# Altium schematic sheet DiplomScheme.SchDoc
size A0; SheetNumber: 1; SheetTotal: 1
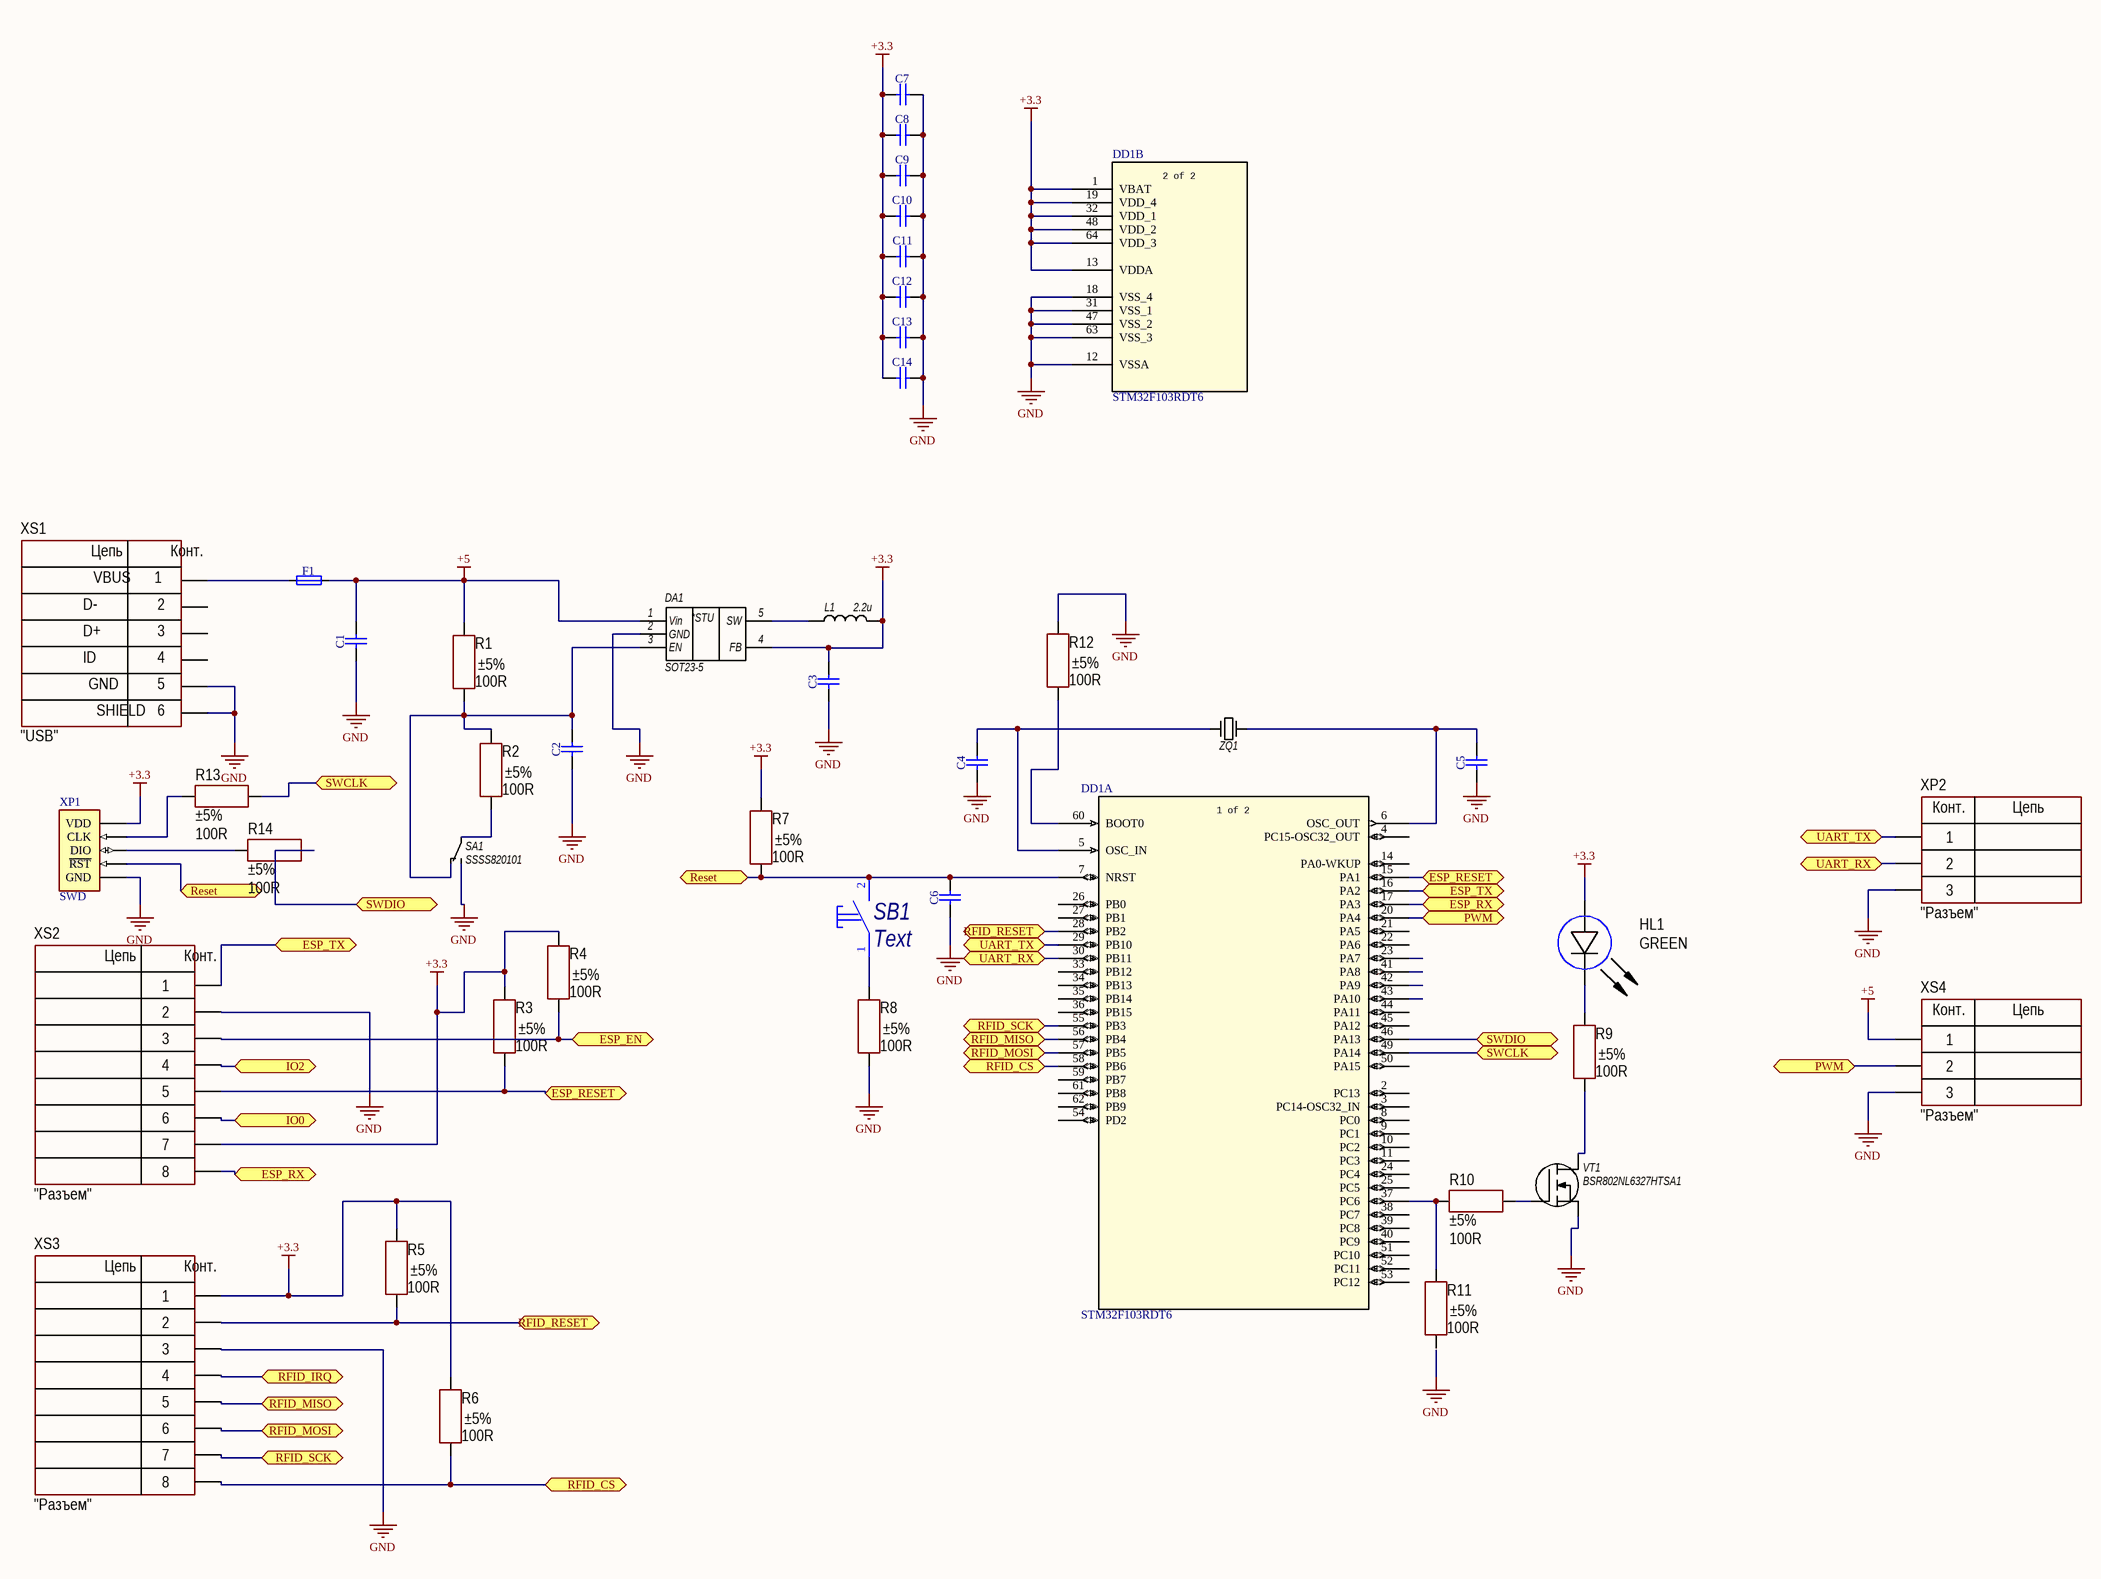
[diagram p0: DiplomScheme.SchDoc]

## Parts
C1  47p  [C0805]  (value not drawn)
C2  47p  [C0805]  (value not drawn)
C3  47p  [C0805]  (value not drawn)
C4  47p  [C0805]  (value not drawn)
C5  47p  [C0805]  (value not drawn)
C6  47p  [C0805]  (value not drawn)
C7  47p  [C0805]  (value not drawn)
C8  47p  [C0805]  (value not drawn)
C9  47p  [C0805]  (value not drawn)
C10  47p  [C0805]  (value not drawn)
C11  47p  [C0805]  (value not drawn)
C12  47p  [C0805]  (value not drawn)
C13  47p  [C0805]  (value not drawn)
C14  47p  [C0805]  (value not drawn)
DA1  SOT23-5  [SOT23-5]
DD1  STM32F103RDT6  [LQFP64-10x10mm]  (parts A,B of 2)
F1  0.14A-60V  [FUSRC4632X90N]  (value not drawn)
HL1  Color: GREEN  [LED: 1206R]
L1  2.2u  [CDRH103R]
R1  value 100R  Tolerance: ±5%  [R0805]
R2  value 100R  Tolerance: ±5%  [R0805]
R3  value 100R  Tolerance: ±5%  [R0805]
R4  value 100R  Tolerance: ±5%  [R0805]
R5  value 100R  Tolerance: ±5%  [R0805]
R6  value 100R  Tolerance: ±5%  [R0805]
R7  value 100R  Tolerance: ±5%  [R0805]
R8  value 100R  Tolerance: ±5%  [R0805]
R9  value 100R  Tolerance: ±5%  [R0805]
R10  value 100R  Tolerance: ±5%  [R0805]
R11  value 100R  Tolerance: ±5%  [R0805]
R12  value 100R  Tolerance: ±5%  [R0805]
R13  value 100R  Tolerance: ±5%  [R0805]
R14  value 100R  Tolerance: ±5%  [R0805]
SA1  SSSS820101  [SSSS820101]
SB1  Text  [ПКн159-3_4-Series]
VT1  BSR802NL6327HTSA1  [SOT23]
XP1  SWD  [PLS5R]
XP2  CommentText: "Разъем"  [PLS3R]
XS1  CommentText: "USB"  [CON: USB micro-A (ZX62-B-5PA)]
XS2  CommentText: "Разъем"  [CON: PBD-8]
XS3  CommentText: "Разъем"  [CON: PBS-8]
XS4  CommentText: "Разъем"  [CON: DG350-3.5-03P]
ZQ1  QSMD3.2x2.5x0.8  [QSMD3.2x2.5x0.8]  (value not drawn)

## Ports
ESP_EN (bidir), ESP_RESET (bidir), ESP_RX (bidir), ESP_TX (bidir), IO0 (bidir), IO2 (bidir), PWM (bidir), Reset (bidir), RFID_CS (bidir), RFID_IRQ (bidir), RFID_MISO (bidir), RFID_MOSI (bidir), RFID_RESET (bidir), RFID_SCK (bidir), SWCLK (bidir), SWDIO (bidir), UART_RX (bidir), UART_TX (bidir)

## Nets
+3.3: C3.2 C7.1 C8.1 C9.1 C10.1 C11.1 C12.1 C13.1 C14.1 DA1.4(FB) DD1.1(VBAT) DD1.13(VDDA) DD1.19(VDD_4) DD1.32(VDD_1) DD1.48(VDD_2) DD1.64(VDD_3) HL1.1(A) L1.2 R3.2 R4.2 R5.2 R6.2 R7.2 XP1.VDD XS2.7 XS3.1
+5: C1.2 DA1.1(Vin) F1.2 R1.2 XS4.1
GND: C1.1 C2.1 C3.1 C4.1 C5.1 C6.1 C7.2 C8.2 C9.2 C10.2 C11.2 C12.2 C13.2 C14.2 DA1.2(GND) DD1.12(VSSA) DD1.18(VSS_4) DD1.31(VSS_1) DD1.47(VSS_2) DD1.63(VSS_3) R8.1 R12.2 SA1.1 VT1.2(Source) XP1.GND XP2.3 XS1.0 XS1.5 XS2.2 XS3.3 XS4.3
ESP_EN: R4.1 XS2.3 ; port ESP_EN
ESP_RESET: DD1.15(PA1) R3.1 XS2.5 ; port ESP_RESET
ESP_RX: DD1.17(PA3) XS2.8 ; port ESP_RX
ESP_TX: DD1.16(PA2) XS2.1 ; port ESP_TX
IO0: XS2.6 ; port IO0
IO2: XS2.4 ; port IO2
PWM: DD1.20(PA4) XS4.2 ; port PWM
Reset: C6.2 DD1.7(NRST) R7.1 SB1.2 XP1.NRST(~{RST}) ; port Reset
RFID_CS: DD1.58(PB6) R6.1 XS3.8 ; port RFID_CS
RFID_IRQ: XS3.4 ; port RFID_IRQ
RFID_MISO: DD1.56(PB4) XS3.5 ; port RFID_MISO
RFID_MOSI: DD1.57(PB5) XS3.6 ; port RFID_MOSI
RFID_RESET: DD1.28(PB2) R5.1 XS3.2 ; port RFID_RESET
RFID_SCK: DD1.55(PB3) XS3.7 ; port RFID_SCK
SWCLK: DD1.49(PA14) R13.1 ; port SWCLK
SWDIO: DD1.46(PA13) R14.1 ; port SWDIO
UART_RX: DD1.30(PB11) XP2.2 ; port UART_RX
UART_TX: DD1.29(PB10) XP2.1 ; port UART_TX
NetC2_2: C2.2 DA1.3(EN) R1.1 R2.2 SA1.3
NetC4_2: C4.2 DD1.5(OSC_IN) ZQ1.3
NetC5_2: C5.2 DD1.6(OSC_OUT) ZQ1.1
NetDA1_5: DA1.5(SW) L1.1
NetDD1_37: DD1.37(PC6) R10.2 R11.2
NetDD1_60: DD1.60(BOOT0) R12.1
NetF1_1: F1.1 XS1.1
NetHL1_2: HL1.2(C) R9.2
NetR2_1: R2.1 SA1.2
NetR8_2: R8.2 SB1.1
NetR9_1: R9.1 VT1.3(Drain)
NetR10_1: R10.1 VT1.1(Gate)
NetR13_2: R13.2 XP1.CLK
NetR14_2: R14.2 XP1.DIO

Not connected (* = marked no-connect by the designer): DD1 2(PC13) 3(PC14-OSC32_IN) 4(PC15-OSC32_OUT) 8(PC0) 9(PC1) 10(PC2) 11(PC3) 14(PA0-WKUP) 21(PA5) 22(PA6) 23(PA7) 24(PC4) 25(PC5) 26(PB0) 27(PB1) 33(PB12) 34(PB13) 35(PB14) 36(PB15) 38(PC7) 39(PC8) 40(PC9) 41(PA8) 42(PA9) 43(PA10) 44(PA11) 45(PA12) 50(PA15) 51(PC10) 52(PC11) 53(PC12) 54(PD2) 59(PB7) 61(PB8) 62(PB9); R11 1; XS1 2 3 4

## Notes on the sheet
- (in symbol Connector_terminal_3pin) Конт.; Цепь
- (in symbol Connector_USB_micro_B) Цепь; Конт.; VBUS; D-; D+; ID; GND; SHIELD; 6
- (in symbol LM3671MF-3.3/NOPB) *STU
- (in symbol PBD-8) Цепь; Конт.
- (in symbol PBS-8) Цепь; Конт.
- (in symbol PLS-3) Конт.; Цепь
- (in symbol STM32F103RDT6, part A) 1 of 2
- (in symbol STM32F103RDT6, part B) 2 of 2

## Library data of the parts
C1-C14 = CC1206_47PF_100V_10%_NP0: Non-polarised capacitor; Part Description: SMD Multilayer Chip Ceramic Capacitor; Manufacturer: GENERIC; Manufacturer1 Part Number: 12061A470JAT2A; Voltage: 100V; TC: NP0; Tolerance: ±10%; Part Number: CC1206_47PF_100V_10%_NP0; Component Kind: Standard; Component Type: Standard; Footprint: CAPC3216X140N; Pin Count: 2; Value: 47p; Status: Preferred; Manufacturer Part Number: CC1206_47PF_100V_10%_NP0; Case: 1206; Mounted: Yes; Socket: No; SMD: Yes; Manufacturer1 Example: AVX; Manufacturer1 ComponentHeight: 0.94mm; HelpURL: \\cern.ch\dfs\Applications\Altium\Datasheets\CC1206_NP0_AVX.pdf; Author: CERN DEM JLC; CreateDate: 24-Aug-09; LatestRevisionDate: 24-Aug-09
DA1 = LM3671MF-3.3/NOPB: GOST DC-DC Step-down converter 2.7-5.5 to 3.3V 600mA output
DD1 = STM32F103RDT6: No Description Available; SourceLibrary: Updates_to_database_2020-10-19; Built_By: EMA_UL_Team; Vendor: STMicroelectronics; Copyright: Copyright (C) 2018 Accelerated Designs. All rights reserved; Manufacturer_Part_Number: STM32F103RDT6; RefDes: RefDes; Type: DEV
F1 = FUSR1812_TYCO-miniSMD0114F: Fuse; Part Description: PolySwitch® PTC Overcurrent Protection Device; Manufacturer: TYCO ELECTRONICS; Manufacturer Part Number: miniSMDC014F; Part Number: FUSR1812_TYCO-miniSMD0114F; Component Kind: Standard; Component Type: Standard; Pin Count: 2; PackageDescription: Chip Resettable Fuse, 2-Leads, Body 4.6x3.2mm, IPC Medium Density; Family: Fuses Resettable; Mounted: Yes; Socket: No; SMD: Yes; Value: 0.14A-60V; ComponentHeight: 0.89mm; HelpURL: \\cern.ch\dfs\Applications\Altium\Datasheets\FUSR_TYCO_MiniSMD0114F.pdf; Author: CERN DEM JLC; CreateDate: 02-Jul-08; LatestRevisionDate: 17-Mar-10
HL1 = LED_single: ValueManufacturerPartNumber: LED, *, *, *, -55...+150°C; TypeDiode: LED; Manufacturer: *; Package: *; HelpURL: *; Temperature: -55...+150°C; Current: *; VoltageDrop: *; PartNumber: *
L1 = Inductive: GOST inductive
R1-R14 = Resistor_1206: Manufacturer: Yageo; PartNumber: RC1206JR-07100RL; ValueManufacturerPartNumber: Resistor film, 100R, ±5%, 1206, 0.25W, -55...+125°C; TypeResistor: Resistor film; Power: 0.25W; Package: 1206; HelpURL: https://www.digikey.com/product-detail/en/yageo/RC1206JR-07100RL/311-100ERCT-ND/732153; Temperature: -55...+125°C
SA1 = Button_Perekluchatel: GOST Button Perekluchatel
SB1 = ПКн159-3: ID: 24; Limit Voltage: 15V; Limit Current: 50mA; Resistance: 0.1ohm; Isolator Resistance: 1000meg; Backlight: NO; Number of Contacts: 4; Specification: АУБК.642130.004 ТУ; Application Category: 1; Working Temperature Min: -60°С; Working Temperature Max: +60°С; Published: 17.04.2014; Publisher: Andrew Danich; Type: Переключатель; Part Number: ПКн159-3; Value: ПКн159-3; Height: 5.2mm
VT1 = MOSFET_N: GOST MOSFET N-channel transistor
XP1 = SWD: Serial Wire Debugging; pin to pad: CLK>2 DIO>3 GND>5 NRST>4 VDD>1; Publisher: Kernel Laboratory; Published: 24.01.2018; Version: 1.0; ComponentLink1Description: Datasheet for Hitec Servo; ComponentLink1URL: https://www.arm.com/files/pdf/Serial_Wire_Debug.pdf
XP2 = PLS-3: Manufacturer: Connfly; ValueManufacturerPartNumber: Connector, 3pin, 2.54mm, 500VAC, 3A; TypeConnector: Connector; VoltageMax: 500VAC; Pitch: 2.54mm; CurrentMax: 3A; Multichannel: 3pin; HelpURL: https://www.chipdip.ru/product/pls-3; PartNumber: PLS-3
XS1 = Connector_USB_micro_B: Manufacturer: Hirose Electric; ValueManufacturerPartNumber: USB micro B; PartNumber: ZX62-B-5PA; HelpURL: https://www.digikey.com/product-detail/en/hirose-electric-co-ltd/ZX62-B-5PA/H11579CT-ND/1851090; TypeConnector: USB micro B
XS2 = PBD-8: Manufacturer: Connfly; ValueManufacturerPartNumber: Connector, 8pin, 2.54mm, 500VAC, 3A; TypeConnector: Connector; VoltageMax: 500VAC; Pitch: 2.54mm; CurrentMax: 3A; Multichannel: 8pin; HelpURL: https://www.chipdip.ru/product/pbd-8; PartNumber: PBD-8
XS3 = PBS-8: Manufacturer: Connfly; ValueManufacturerPartNumber: Connector, 8pin, 2.54mm, 500VAC, 3A; TypeConnector: Connector; VoltageMax: 500VAC; Pitch: 2.54mm; CurrentMax: 3A; Multichannel: 8pin; HelpURL: https://www.chipdip.ru/product/pbs-8; PartNumber: PBS-8
XS4 = Connector_terminal_3pin: Manufacturer: Degson; ValueManufacturerPartNumber: Terminal connector, 3pin, 3.5mm, 300VAC, 10A; PartNumber: DG350-3.5-03P-14; TypeConnector: Terminal connector; VoltageMax: 300VAC; Pitch: 3.5mm; CurrentMax: 10A; Multichannel: 3pin; HelpURL: https://www.chipdip.ru/product/dg350-3.5-03p-12
ZQ1 = Quartz: GOST Quartz